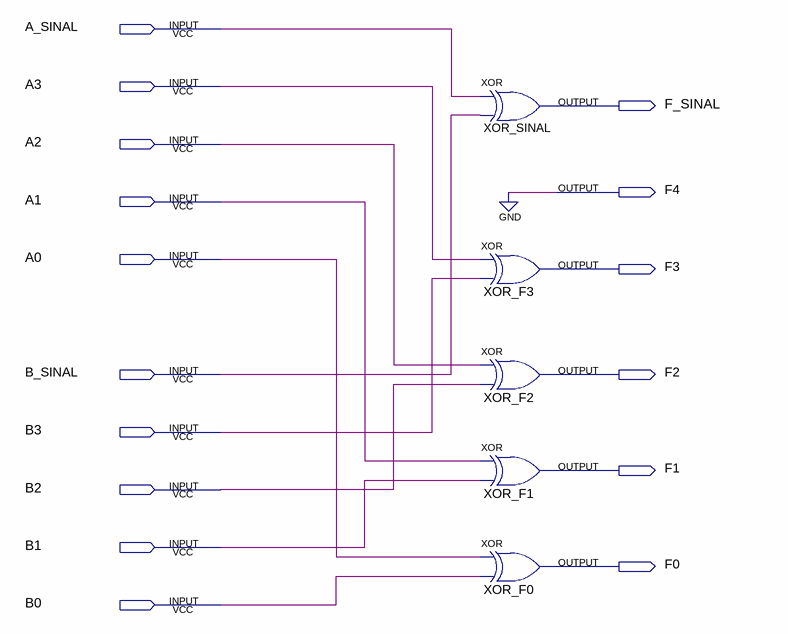
[diagram p0: schematic sheet]
// Quartus schematic CircuitoXOR.bdf as structural Verilog: 5 symbols, 16 pins
module CircuitoXOR (
  input  A_SINAL,
  input  A3,
  input  A2,
  input  A1,
  input  A0,
  input  B_SINAL,
  input  B3,
  input  B2,
  input  B1,
  input  B0,
  output F_SINAL,
  output F4,
  output F3,
  output F2,
  output F1,
  output F0
);

  xor XOR_SINAL (F_SINAL, A_SINAL, B_SINAL);
  xor XOR_F3 (F3, A3, B3);
  xor XOR_F2 (F2, A2, B2);
  xor XOR_F1 (F1, A1, B1);
  xor XOR_F0 (F0, A0, B0);

  assign F4 = 1'b0;
endmodule
